# EAGLE design Balloon (EAGLE 6.2)
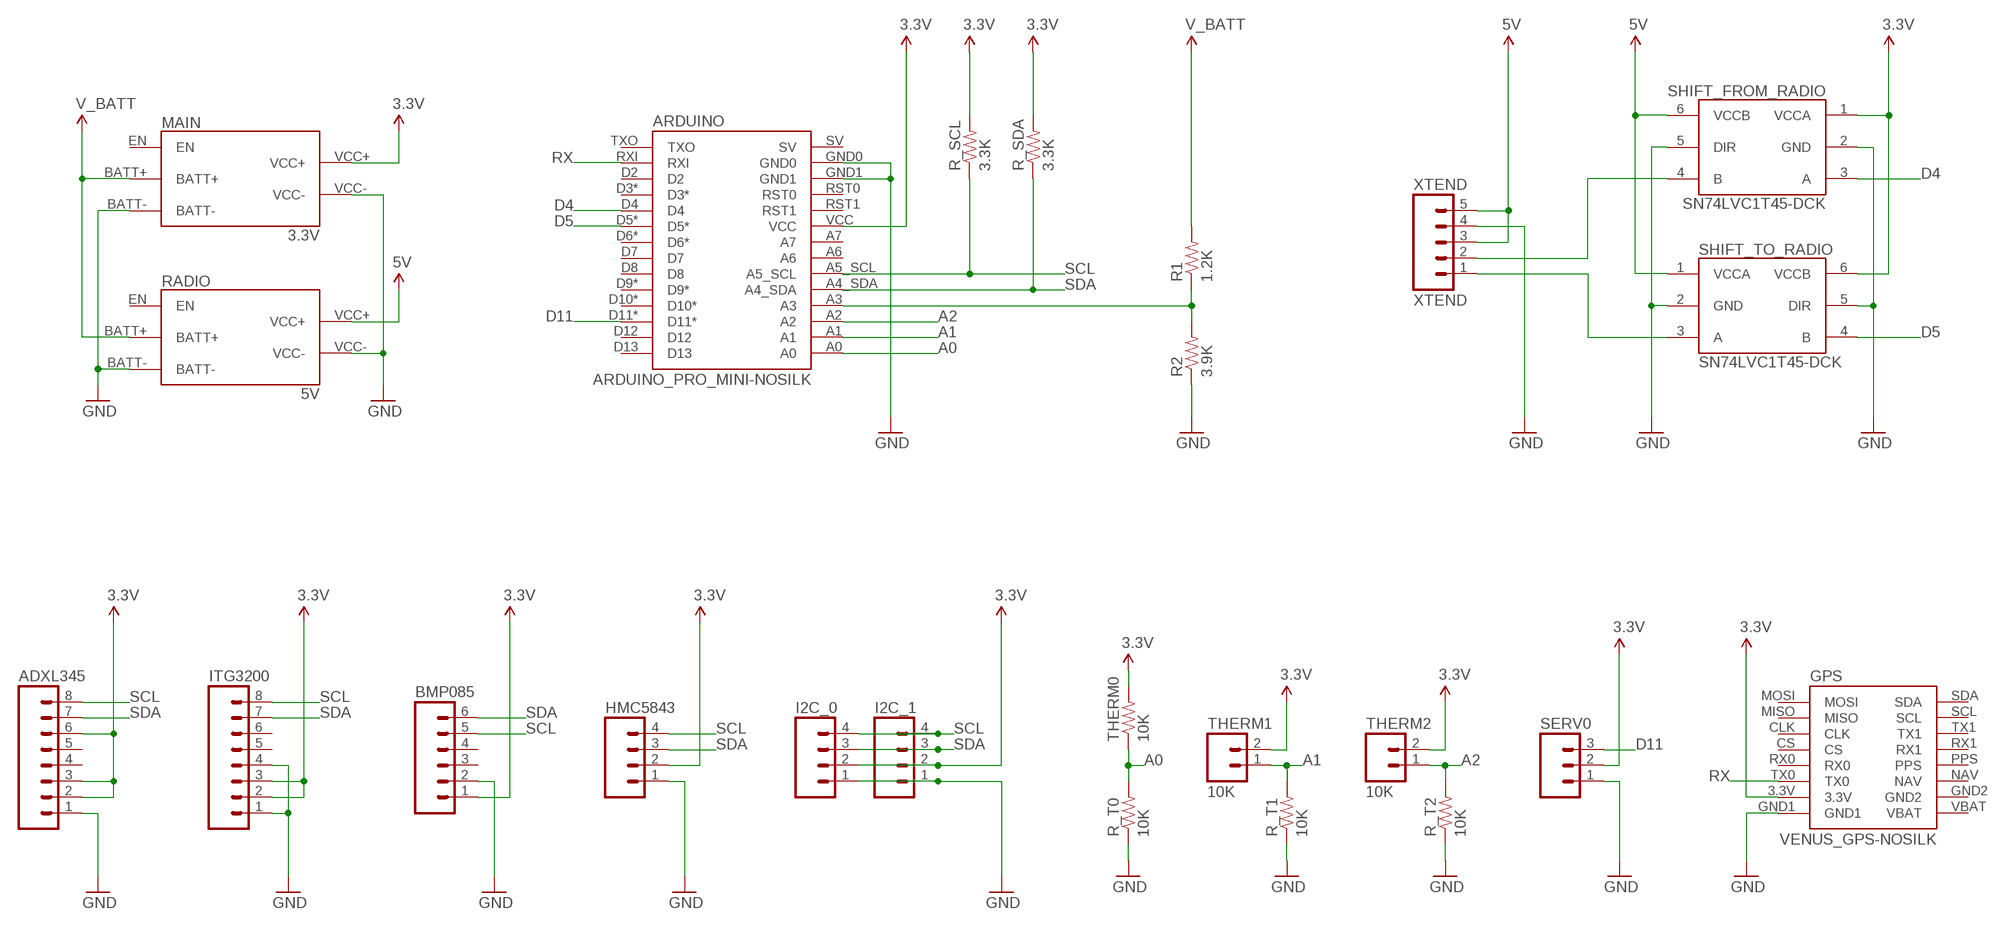
[diagram p0: schematic, sheet 1]

## Parts
ADXL345  M081X08  [1X08]
ARDUINO  ARDUINO_PRO_MINI-NOSILK  [ARDUINO_PRO_MINI-NOSILK]
BMP085  M06SIP  [1X06]
GPS  VENUS_GPS-NOSILK  [VENUS_GPS-NOSILK]
HMC5843  M04PTH  [1X04]
I2C_0  M04PTH  [1X04]
I2C_1  M04PTH  [1X04]
ITG3200  M081X08  [1X08]
MAIN  3.3V  POWER-TPS6300X-NOSILK  [POWER-TPS6300X-NOSILK]
R1  1.2K  RESISTOR0805-RES  [0805]
R2  3.9K  RESISTOR0805-RES  [0805]
R_SCL  3.3K  RESISTOR0805-RES  [0805]
R_SDA  3.3K  RESISTOR0805-RES  [0805]
R_T0  10K  RESISTOR0805-RES  [0805]
R_T1  10K  RESISTOR0805-RES  [0805]
R_T2  10K  RESISTOR0805-RES  [0805]
RADIO  5V  POWER-TPS6300X-NOSILK  [POWER-TPS6300X-NOSILK]
SERV0  M03PTH  [1X03]
SHIFT_FROM_RADIO  SN74LVC1T45-DCK  [SC70]
SHIFT_TO_RADIO  SN74LVC1T45-DCK  [SC70]
THERM0  10K  RESISTOR0805-RES  [0805]
THERM1  10K  M02JST-PTH-2  [JST-2-PTH]
THERM2  10K  M02JST-PTH-2  [JST-2-PTH]
XTEND  XTEND  M05JST-PTH-VERT  [JST-5-PTH-VERT]

## Nets
1.8V: MAIN.BATT+ R1.2 RADIO.BATT+ ; supply symbol labelled V_BATT
3.3V: ADXL345.2 ADXL345.3 ADXL345.6 ARDUINO.VCC BMP085.1 GPS.3.3V HMC5843.2 I2C_0.2 I2C_1.2 ITG3200.2 ITG3200.3 MAIN.VCC+ R_SCL.2 R_SDA.2 SERV0.2 SHIFT_FROM_RADIO.1(VCCA) SHIFT_TO_RADIO.6(VCCB) THERM0.2 THERM1.2 THERM2.2
5V: RADIO.VCC+ SHIFT_FROM_RADIO.6(VCCB) SHIFT_TO_RADIO.1(VCCA) XTEND.3 XTEND.5
A0: ARDUINO.A0 R_T0.2 THERM0.1
A1: ARDUINO.A1 R_T1.2 THERM1.1
A2: ARDUINO.A2 R_T2.2 THERM2.1
D4: ARDUINO.D4 SHIFT_FROM_RADIO.3(A)
D5: ARDUINO.D5* SHIFT_TO_RADIO.4(B)
D11: ARDUINO.D11* SERV0.3
GND: ADXL345.1 ARDUINO.GND0 ARDUINO.GND1 BMP085.2 GPS.GND1 HMC5843.1 I2C_0.1 I2C_1.1 ITG3200.1 ITG3200.4 MAIN.BATT- MAIN.VCC- R2.1 R_T0.1 R_T1.1 R_T2.1 RADIO.BATT- RADIO.VCC- SERV0.1 SHIFT_FROM_RADIO.2(GND) SHIFT_FROM_RADIO.5(DIR) SHIFT_TO_RADIO.2(GND) SHIFT_TO_RADIO.5(DIR) XTEND.4
N$1: SHIFT_FROM_RADIO.4(B) XTEND.2
N$2: ARDUINO.A3 R1.1 R2.2
N$3: SHIFT_TO_RADIO.3(A) XTEND.1
RX: ARDUINO.RXI GPS.TX0
SCL: ADXL345.8 ARDUINO.A5_SCL BMP085.5 HMC5843.4 I2C_0.4 I2C_1.4 ITG3200.8 R_SCL.1
SDA: ADXL345.7 ARDUINO.A4_SDA BMP085.6 HMC5843.3 I2C_0.3 I2C_1.3 ITG3200.7 R_SDA.1
Unconnected: ADXL345.4 ADXL345.5 ARDUINO.A6 ARDUINO.A7 ARDUINO.D2 ARDUINO.D3* ARDUINO.D6* ARDUINO.D7 ARDUINO.D8 ARDUINO.D9* ARDUINO.D10* ARDUINO.D12 ARDUINO.D13 ARDUINO.RST0 ARDUINO.RST1 ARDUINO.SV ARDUINO.TXO BMP085.3 BMP085.4 GPS.CLK GPS.CS GPS.GND2 GPS.MISO GPS.MOSI GPS.NAV GPS.PPS GPS.RX0 GPS.RX1 GPS.SCL GPS.SDA GPS.TX1 GPS.VBAT ITG3200.5 ITG3200.6 MAIN.EN RADIO.EN

## Library data of the parts
ADXL345 ITG3200 = SparkFun:M08: Header 8 Standard 8-pin 0.1" header. Use with straight break away headers (SKU : PRT-00116), right angle break away headers (PRT-00553), swiss pins (PRT-00743), machine pins (PRT-00117), and female headers (PRT-00115).
ARDUINO = OpenSpace:ARDUINO_PRO_MINI
BMP085 = SparkFun:M06: Header 6 Standard 6-pin 0.1" header. Use with straight break away headers (SKU : PRT-00116), right angle break away headers (PRT-00553), swiss pins (PRT-00743), machine pins (PRT-00117), and female headers (PRT-00115). Molex polarized connector foot print use with SKU : PRT-08094 with associated crimp pins and housings. NOTES ON THE VARIANTS LOCK and LOCK_LONGPADS... This footprint was designed to help hold the alignment of a through-hole component (i.e. 6-pin header) while soldering it into place. You may notice that each hole has been shifted either up or down by 0.005 of an inch from it's more standard position (which is a perfectly straight line). This slight alteration caused the pins (the squares in the middle) to touch the edges of the holes. Because they are alternating, it causes a "brace" to hold the component in place. 0.005 has proven to be the perfect amount of "off-center" position when using our standard breakaway headers. Although looks a little odd when you look at the bare footprint, once you have a header in there, the alteration is very hard to notice. Also, if you push a header all the way into place, it is covered up entirely on the bottom side. This idea of altering the position of holes to aid alignment will be further integrated into the Sparkfun Library for other footprints. It can help hold any component with 3 or more connection pins.
GPS = OpenSpace:VENUS_GPS
HMC5843 = SparkFun:M04: Header 4 Standard 4-pin 0.1" header. Use with straight break away headers (SKU : PRT-00116), right angle break away headers (PRT-00553), swiss pins (PRT-00743), machine pins (PRT-00117), and female headers (PRT-00115). Molex polarized connector foot print use with SKU : PRT-08231 with associated crimp pins and housings. 1MM SMD Version SKU: PRT-10208
I2C_0 I2C_1 = SparkFun-Connectors:M04: Header 4 Standard 4-pin 0.1" header. Use with straight break away headers (SKU : PRT-00116), right angle break away headers (PRT-00553), swiss pins (PRT-00743), machine pins (PRT-00117), and female headers (PRT-00115). Molex polarized connector foot print use with SKU : PRT-08231 with associated crimp pins and housings. 1MM SMD Version SKU: PRT-10208
MAIN RADIO = OpenSpace:POWER
R1 R2 R_SCL R_SDA R_T0 R_T1 R_T2 THERM0 = SparkFun-Passives:RESISTOR: Resistor Basic schematic elements and footprints for 0603, 1206, and PTH resistors.
SERV0 = SparkFun-Connectors:M03: Header 3 Standard 3-pin 0.1" header. Use with straight break away headers (SKU : PRT-00116), right angle break away headers (PRT-00553), swiss pins (PRT-00743), machine pins (PRT-00117), and female headers (PRT-00115). Molex polarized connector foot print use with SKU : PRT-08232 with associated crimp pins and housings.
SHIFT_FROM_RADIO SHIFT_TO_RADIO = OpenSpace:SN74LVC1T45
THERM1 THERM2 = SparkFun-Connectors:M02: Header 2 Standard 2-pin 0.1" header. Use with straight break away headers (SKU : PRT-00116), right angle break away headers (PRT-00553), swiss pins (PRT-00743), machine pins (PRT-00117), and female headers (PRT-00115). Molex polarized connector foot print use with SKU : PRT-08233 with associated crimp pins and housings.
XTEND = SparkFun:M05: Header 5 Standard 5-pin 0.1" header. Use with straight break away headers (SKU : PRT-00116), right angle break away headers (PRT-00553), swiss pins (PRT-00743), machine pins (PRT-00117), and female headers (PRT-00115). Molex polarized connector foot print use with SKU : PRT-08230 with associated crimp pins and housings.

## Board
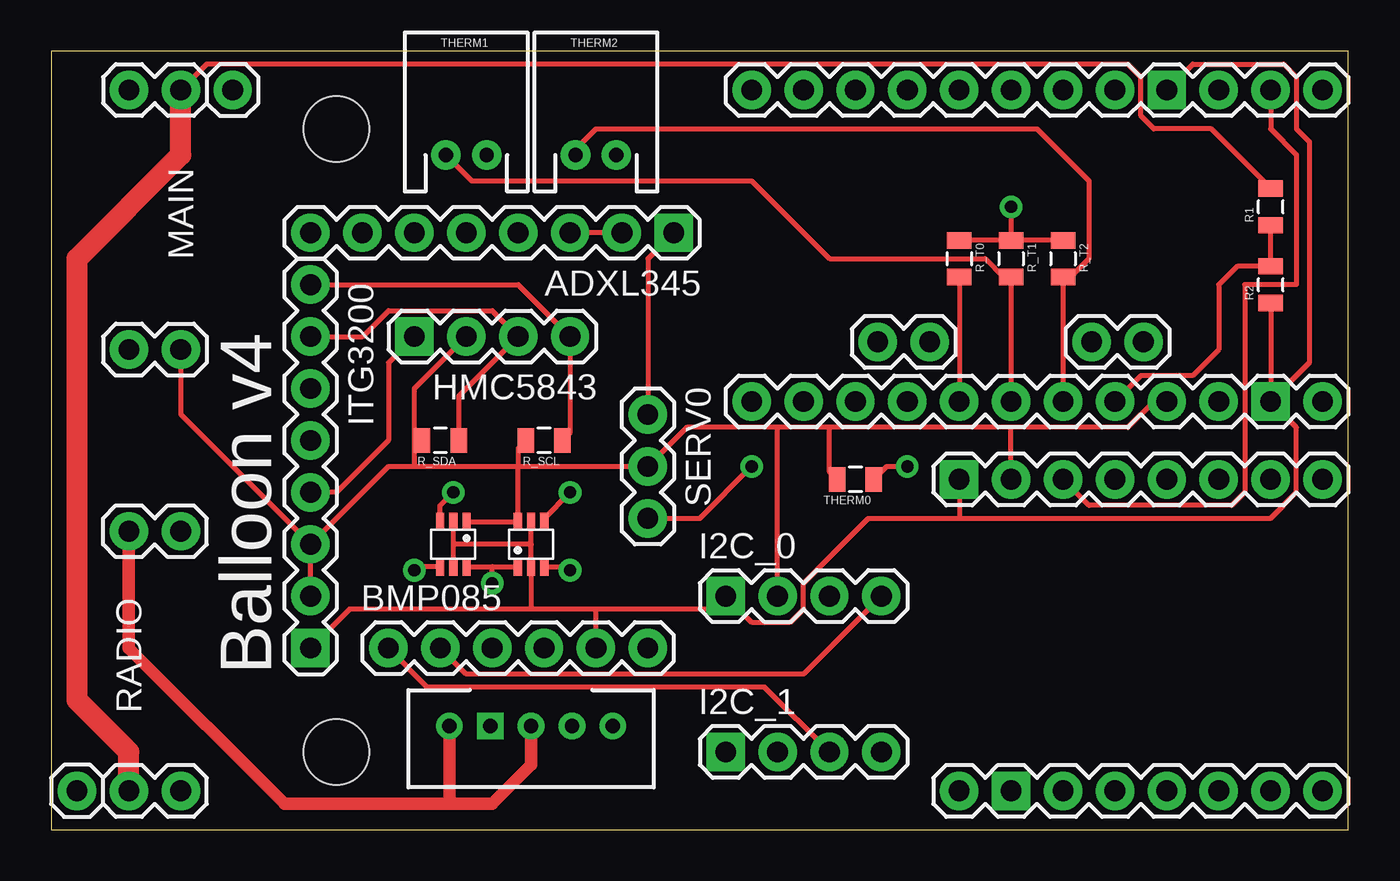
[diagram p1: board, top side]
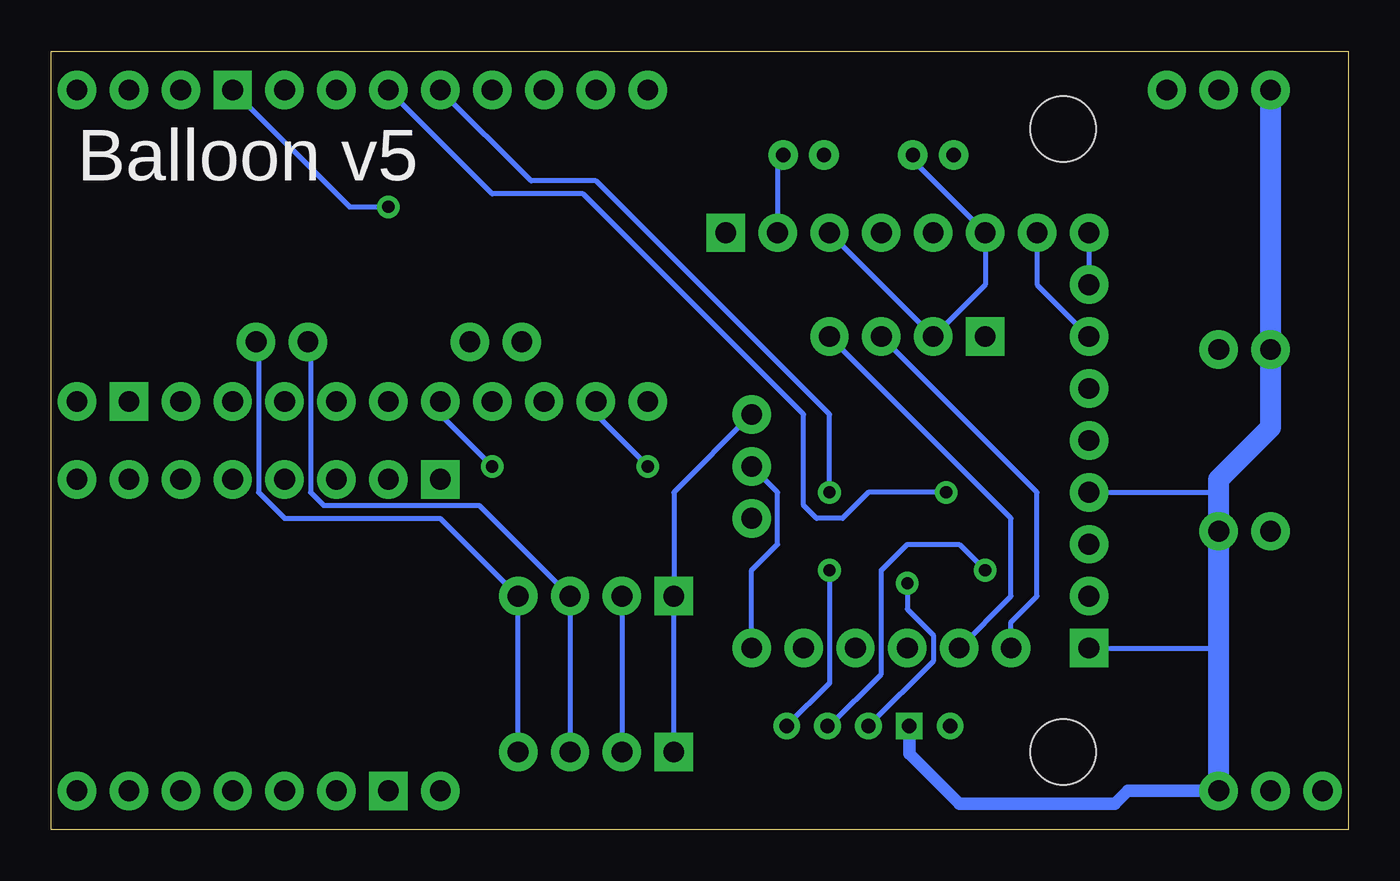
[diagram p2: board, bottom side, seen from below]

Size 63.5 x 38.1 mm. Coordinates in mm from the lower left corner, seen from the top.
Outline: 0,38.1 0,0 63.5,0 63.5,38.1 0,38.1
Copper layers (1*16): Top 0.035mm / dielectric 1.5mm / Bottom 0.035mm
Design rules: minimum track width 8mil, minimum drill 20mil, track to track 8mil, track to pad 8mil, pad to pad 8mil, via to via 8mil, smd to smd 8mil, copper to edge 10mil, drill to drill 8mil, minimum pad ring 12mil, minimum via ring 10mil, stop-mask expansion 4mil, vias tented up to drill 25mil, thermal gap 10mil
Holes 3.2 mm at 13.97,34.29 13.97,3.81

### Footprints (pad centres in the part's own frame; a part is rotated, then mirrored left to right if it is on the bottom)
1X08 = drill 1.016 pad 1.88 square: 1 0,0 | drill 1.016 pad 1.88: 2 2.54,0; 3 5.08,0; 4 7.62,0; 5 10.16,0; 6 12.7,0; 7 15.24,0; 8 17.78,0
ARDUINO_PRO_MINI-NOSILK = drill 1.016 pad 1.88: A0 7.62,-3.81; A1 7.62,-1.27; A2 7.62,1.27; A3 7.62,3.81; A4_SDA 4.699,2.667; A5_SCL 4.699,5.207; A6 4.699,-7.798; A7 4.699,-5.258; D2 -7.62,3.81; D3* -7.62,1.27; D4 -7.62,-1.27; D5* -7.62,-3.81; D6* -7.62,-6.35; D7 -7.62,-8.89; D8 -7.62,-11.43; D9* -7.62,-13.97; D10* 7.62,-13.97; D11* 7.62,-11.43; D12 7.62,-8.89; D13 7.62,-6.35; RST0 -7.62,8.89; RST1 7.62,8.89; RXI -7.62,11.43; SV 7.62,13.97; TXO -7.62,13.97; VCC 7.62,6.35 | drill 1.016 pad 1.88 square: GND0 -7.62,6.35; GND1 7.62,11.43
1X06 = drill 1.016 pad 1.88: 1 0,0; 2 2.54,0; 3 5.08,0; 4 7.62,0; 5 10.16,0; 6 12.7,0
VENUS_GPS-NOSILK = drill 1.016 pad 1.88: 3.3V -7.62,-6.35; CLK -7.62,3.81; CS -7.62,1.27; MISO -7.62,6.35; MOSI -7.62,8.89; NAV 7.62,-3.81; PPS 7.62,-1.27; RX0 -7.62,-1.27; RX1 7.62,1.27; SCL 7.62,6.35; SDA 7.62,8.89; TX0 -7.62,-3.81; TX1 7.62,3.81; VBAT 7.62,-8.89 | drill 1.016 pad 1.88 square: GND1 -7.62,-8.89; GND2 7.62,-6.35
1X04 = drill 1.016 pad 1.88 square: 1 0,0 | drill 1.016 pad 1.88: 2 2.54,0; 3 5.08,0; 4 7.62,0
POWER-TPS6300X-NOSILK = drill 1.016 pad 1.88: BATT+ -2.54,1.27; BATT- -2.54,-1.27; EN -2.54,3.81; VCC+ 10.16,1.27; VCC- 10.16,-1.27
0805 = smd 0.8 x 1.2: 1 -0.9,0; 2 0.9,0
1X03 = drill 1.016 pad 1.88: 1 0,0; 2 2.54,0; 3 5.08,0
SC70 = smd 0.4 x 0.9: 1 -0.65,-1.1; 2 0,-1.1; 3 0.65,-1.1; 4 0.65,1.1; 5 0,1.1; 6 -0.65,1.1
JST-2-PTH = drill 0.7 pad 1.448: 1 -1,0; 2 1,0
JST-5-PTH-VERT = drill 0.7: 1 -4,0; 2 -2,0; 3 0,0; 5 4,0 | drill 0.7 square: 4 2,0

### Placement (x,y rotation side)
ADXL345  30.48,29.21 180 top
ARDUINO  48.26,28.57 270 top
BMP085  29.21,8.89 180 top
GPS  53.34,9.53 270 top
HMC5843  17.78,24.13 0 top
I2C_0  33.02,11.43 0 top
I2C_1  33.02,3.81 0 top
ITG3200  12.7,8.89 90 top
MAIN  5.08,33.66 270 top
R1  59.69,30.48 90 top
R2  59.69,26.67 90 top
R_SCL  24.13,19.05 180 top
R_SDA  19.05,19.05 180 top
R_T0  44.45,27.94 270 top
R_T1  46.99,27.94 270 top
R_T2  49.53,27.94 270 top
RADIO  5.08,4.45 90 top
SERV0  29.21,20.32 270 top
SHIFT_FROM_RADIO  19.68,13.97 180 top
SHIFT_TO_RADIO  23.5,13.97 0 top
THERM0  39.37,17.14 180 top
THERM1  20.32,33.02 0 top
THERM2  26.67,33.02 0 top
XTEND  23.5,5.08 180 top

### Tracks (layer width: path | path; a pad name or v marks a point on that pad's centre or on a via)
1.8V
  Top 0.254: R1.2 56.78,34.29 53.98,34.29 53.34,34.92 53.34,36.83 52.7,37.47 7.62,37.47 MAIN.BATT+
  Top 1.016: RADIO.BATT+ 3.81,3.81 1.27,6.35 1.27,27.94 6.35,33.02 MAIN.BATT+
3.3V
  Top 0.254: MAIN.VCC+ 6.35,20.32 ITG3200.3 | ITG3200.2 ITG3200.3 | ITG3200.3 16.51,17.78 17.78,17.78 | 17.78,17.78 22.86,17.78 | 22.86,17.78 SERV0.2 31.11,19.68 35.56,19.68 | ARDUINO.VCC 53.98,20.95 52.7,19.68 46.99,19.68 | 46.99,19.68 38.1,19.68 | 38.1,19.68 35.56,19.68 | GPS.3.3V 46.99,19.68 | SHIFT_FROM_RADIO.1 SHIFT_TO_RADIO.6 22.84,17.77 22.86,17.78 | R_SCL.2 22.86,18.68 22.86,17.78 | R_SDA.2 17.78,18.68 | 17.78,18.68 17.78,17.78 | HMC5843.2 17.78,21.59 17.78,18.68 | THERM0.2 38.1,17.52 38.1,19.68 | ADXL345.2 ADXL345.3 | I2C_0.2 35.56,19.68
  Bottom 0.254: THERM2.2 27.94,32.75 ADXL345.2 | I2C_0.2 I2C_1.2 | ADXL345.3 HMC5843.2 17.78,26.67 ADXL345.6 21.32,32.75 THERM1.2 | BMP085.1 29.21,12.7 27.94,13.97 27.94,16.51 SERV0.2
5V  (via drill 0.6)
  Top 0.254: SHIFT_FROM_RADIO.6 21.59,12.87 | 21.59,12.87 SHIFT_TO_RADIO.1 | v21.59,12.06 21.59,12.87
  Top 0.61: RADIO.VCC+ 3.81,8.89 11.43,1.27 19.5,1.27 | 19.5,1.27 21.59,1.27 23.5,3.17 XTEND.3 | XTEND.5 19.5,1.27
  Bottom 0.254: v21.59,12.06 21.59,10.79 20.32,9.53 20.32,8.26 XTEND.3
A0  (via drill 0.6)
  Top 0.254: THERM0.1 40.91,17.78 v41.91,17.78 | R_T0.2 ARDUINO.A0
  Bottom 0.254: v41.91,17.78 44.45,20.32 ARDUINO.A0
A1
  Top 0.254: ARDUINO.A1 R_T1.2 46.62,27.04 45.72,27.94 38.1,27.94 34.29,31.75 20.59,31.75 THERM1.1
A2
  Top 0.254: ARDUINO.A2 R_T2.2 49.9,27.04 50.8,27.94 50.8,31.75 48.26,34.29 26.67,34.29 25.67,33.29 THERM2.1
D4  (via drill 0.6)
  Top 0.254: SHIFT_FROM_RADIO.3 19.04,15.86 v19.68,16.51
  Bottom 0.254: v19.68,16.51 23.5,16.51 24.77,15.24 26.04,15.24 26.67,15.88 26.67,20.32 37.47,31.11 41.91,31.11 ARDUINO.D4
D5  (via drill 0.6)
  Top 0.254: SHIFT_TO_RADIO.4 24.14,15.26 v25.4,16.51
  Bottom 0.254: v25.4,16.51 25.4,20.32 36.83,31.75 40.01,31.75 ARDUINO.D5*
D11  (via drill 0.6)
  Top 0.254: SERV0.3 31.75,15.24 v34.29,17.78
  Bottom 0.254: v34.29,17.78 36.83,20.32 ARDUINO.D11*
GND  (via drill 0.6)
  Top 0.254: SHIFT_FROM_RADIO.2 19.68,13.97 | 19.68,13.97 SHIFT_FROM_RADIO.5 | 23.5,13.97 SHIFT_TO_RADIO.2 23.5,10.79 | 23.5,13.97 19.68,13.97 | 23.5,13.97 SHIFT_TO_RADIO.5 | 26.67,10.79 32.38,10.79 I2C_0.1 34.29,10.16 36.2,10.16 36.83,10.79 36.83,12.06 40.01,15.24 44.45,15.24 | 26.67,10.79 23.5,10.79 | 23.5,10.79 14.61,10.79 ITG3200.1 | 44.45,15.24 59.69,15.24 60.96,16.51 60.96,19.68 ARDUINO.GND1 | GPS.GND1 44.45,15.24 | HMC5843.1 16.51,22.86 16.51,19.05 13.97,16.51 ITG3200.4 | R_T2.1 R_T1.1 | R_T1.1 R_T0.1 | ARDUINO.GND0 55.88,37.47 60.33,37.47 60.96,36.83 60.96,34.29 61.59,33.66 61.59,22.86 ARDUINO.GND1 | R2.1 ARDUINO.GND1 | v46.99,30.48 R_T1.1 | BMP085.2 26.67,10.79 | ADXL345.1 29.21,27.94 SERV0.1
  Bottom 0.254: ITG3200.4 6.35,16.51 | ITG3200.1 6.35,8.89 | ARDUINO.GND0 48.9,30.48 v46.99,30.48 | I2C_1.1 I2C_0.1 33.02,16.51 SERV0.1
  Bottom 0.61: XTEND.4 21.5,3.71 19.05,1.27 11.43,1.27 10.79,1.91 RADIO.BATT-
  Bottom 1.016: RADIO.BATT- 6.35,8.89 RADIO.VCC- 6.35,16.51 6.35,17.14 3.81,19.68 MAIN.VCC- MAIN.BATT-
N$1  (via drill 0.6)
  Top 0.254: SHIFT_FROM_RADIO.4 17.95,12.87 v17.78,12.7
  Bottom 0.254: XTEND.2 25.4,5.08 22.86,7.62 22.86,12.7 21.59,13.97 19.05,13.97 v17.78,12.7
N$2
  Top 0.254: ARDUINO.A3 53.34,22.23 55.88,22.23 57.15,23.5 57.15,26.67 58.05,27.57 R2.2 R1.1
N$3  (via drill 0.6)
  Top 0.254: SHIFT_TO_RADIO.3 25.23,12.87 v25.4,12.7
  Bottom 0.254: v25.4,12.7 25.4,7.17 XTEND.1
RX
  Top 0.254: ARDUINO.RXI 59.69,34.29 60.96,33.02 60.96,26.67 58.42,26.67 58.42,16.51 57.78,15.88 50.8,15.88 GPS.TX0
SCL
  Top 0.254: R_SCL.1 25.4,19.42 HMC5843.4 22.86,26.67 ITG3200.8 | I2C_0.4 36.83,7.62 20.32,7.62 BMP085.5
  Bottom 0.254: ARDUINO.A5_SCL 53.34,23.75 53.34,16.51 52.07,15.24 44.45,15.24 I2C_0.4 I2C_1.4 | BMP085.5 16.51,11.43 16.51,15.24 HMC5843.4 | ADXL345.8 ITG3200.8
SDA
  Top 0.254: R_SDA.1 19.95,21.22 HMC5843.3 21.59,25.4 16.51,25.4 15.24,24.13 ITG3200.7 | I2C_1.3 34.92,6.99 18.41,6.99 BMP085.6
  Bottom 0.254: ARDUINO.A4_SDA 50.8,23.75 50.8,16.51 50.16,15.88 42.55,15.88 I2C_0.3 I2C_1.3 | BMP085.6 16.51,10.16 15.24,11.43 15.24,16.51 HMC5843.3 | ADXL345.7 15.24,26.67 ITG3200.7

### Text on the board
tPlace: Balloon v4
bPlace: Balloon v5